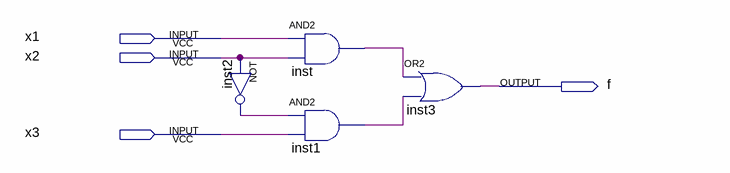
[diagram p0: schematic sheet]
// Quartus schematic Lab1.bdf as structural Verilog: 4 symbols, 4 pins
module Lab1 (
  input  x1,
  input  x2,
  input  x3,
  output f
);

  wire inst1_out, inst2_out, inst_out;

  not inst2 (inst2_out, x2);
  and inst (inst_out, x1, x2);
  and inst1 (inst1_out, inst2_out, x3);
  or inst3 (f, inst_out, inst1_out);
endmodule
